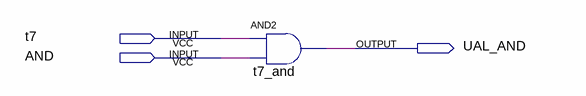
[diagram p0: schematic sheet]
// Quartus schematic ual_and.bdf as structural Verilog: 1 symbols, 3 pins
module ual_and (
  input  t7,
  input  AND,
  output UAL_AND
);

  and t7_and (UAL_AND, t7, AND);
endmodule
